# EAGLE design Active Probe Proto1 (EAGLE 6.1)
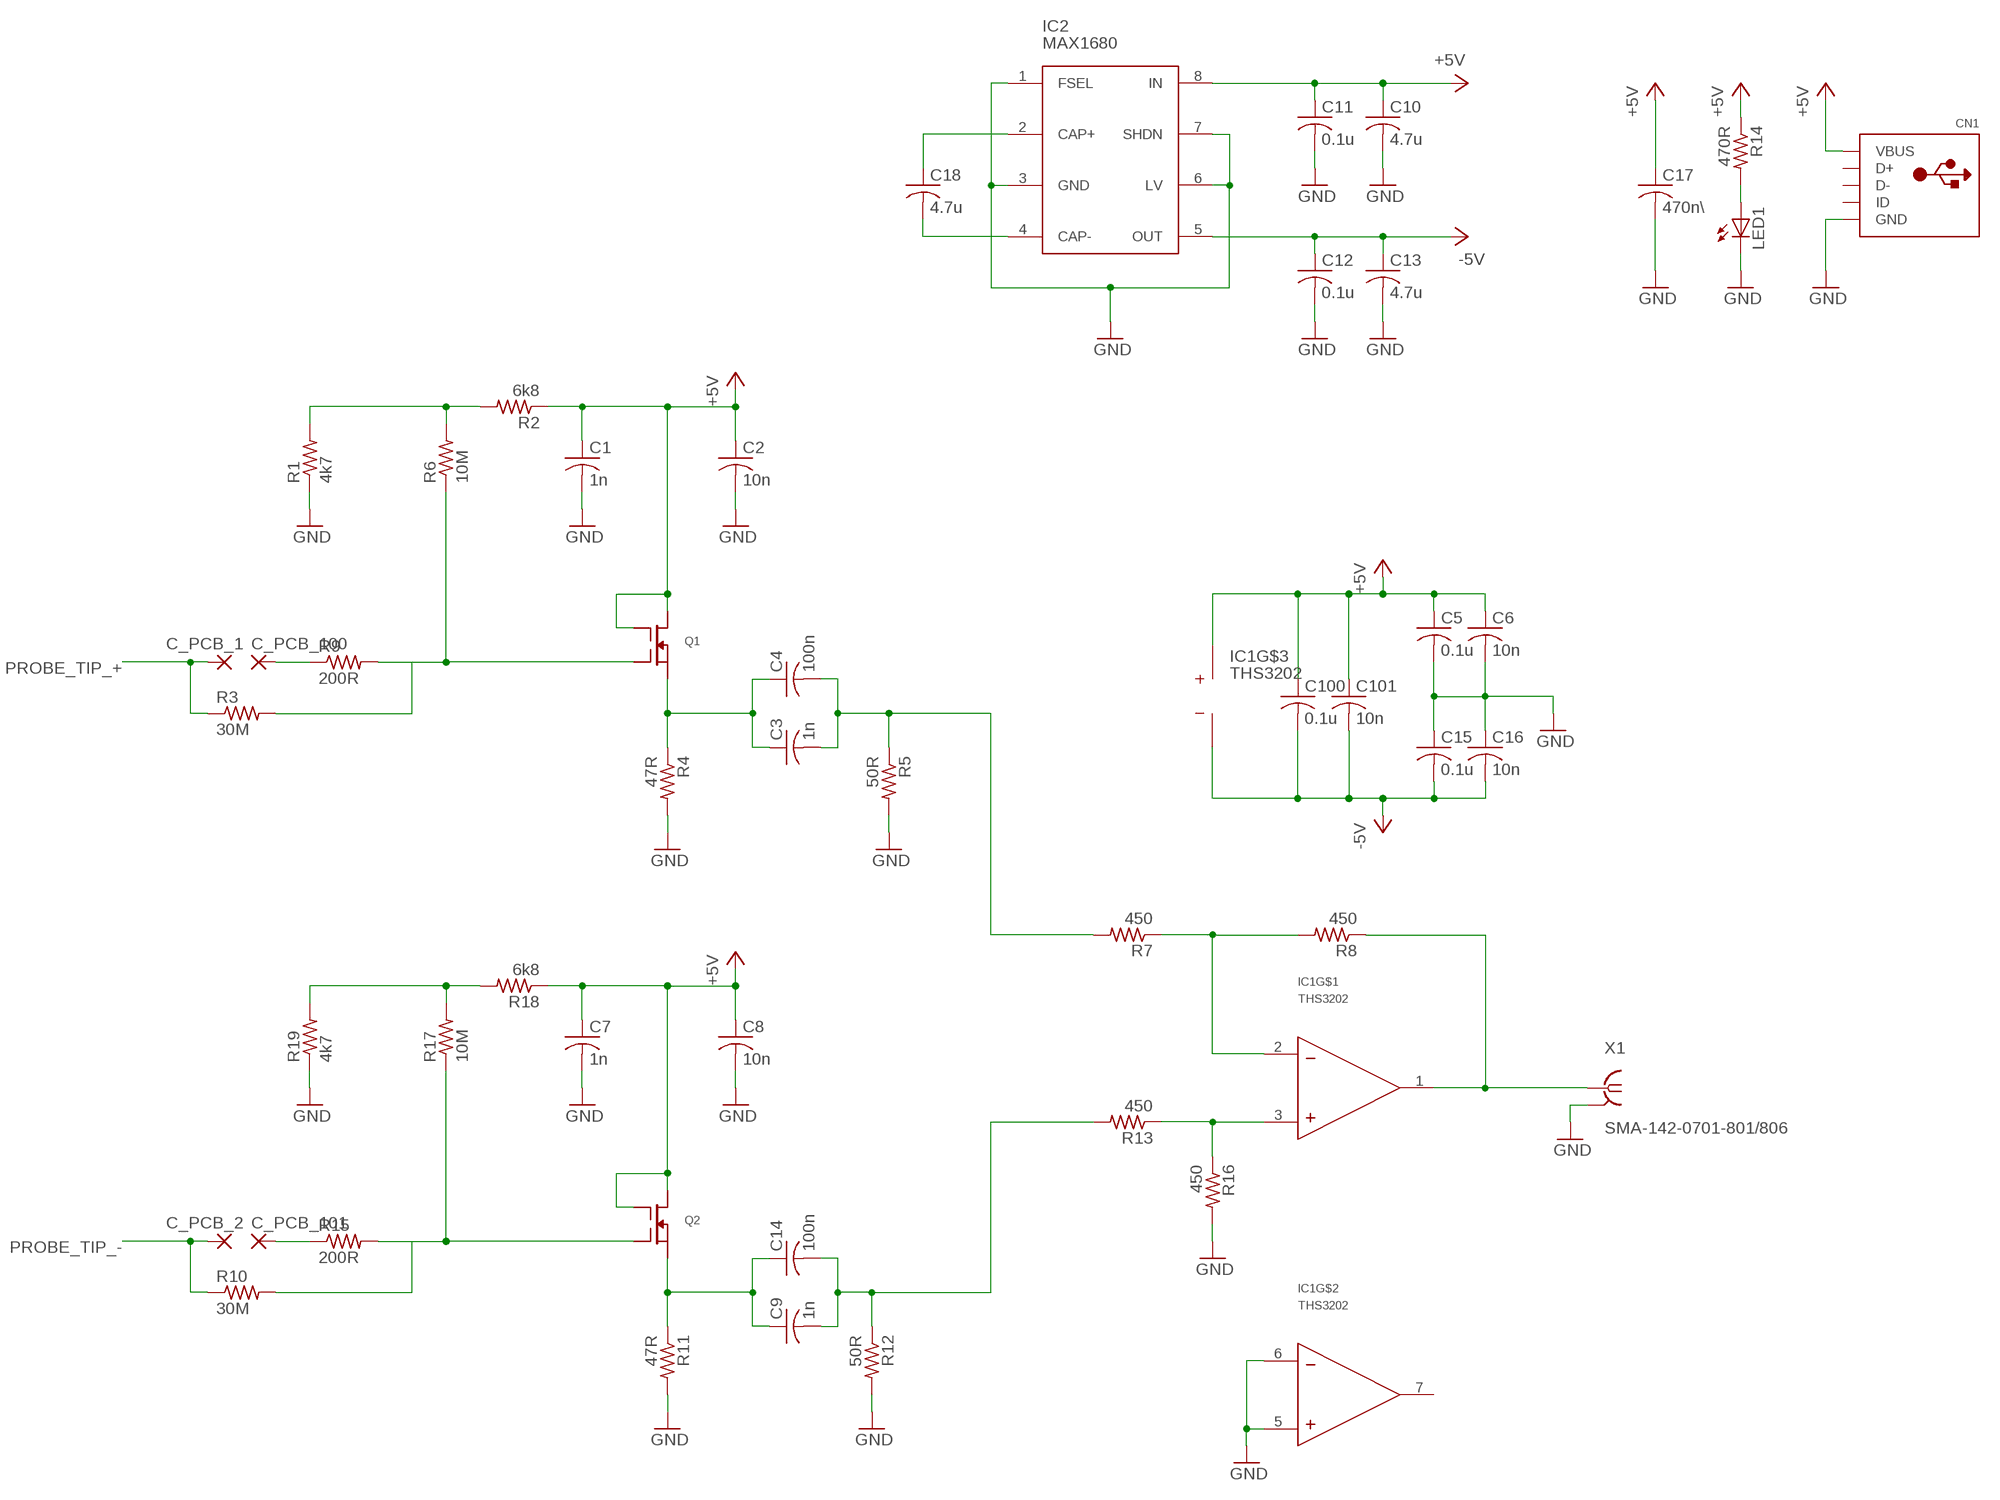
[diagram p0: schematic, sheet 1]

## Parts
C1  1n  C-USC0805  [C0805]
C2  10n  C-USC0805  [C0805]
C3  1n  C-USC0805  [C0805]
C4  100n  C-USC0805  [C0805]
C5  0.1u  C-USC0805  [C0805]
C6  10n  C-USC0805  [C0805]
C7  1n  C-USC0805  [C0805]
C8  10n  C-USC0805  [C0805]
C9  1n  C-USC0805  [C0805]
C10  4.7u  C-USC0805  [C0805]
C11  0.1u  C-USC0805  [C0805]
C12  0.1u  C-USC0805  [C0805]
C13  4.7u  C-USC0805  [C0805]
C14  100n  C-USC0805  [C0805]
C15  0.1u  C-USC0805  [C0805]
C16  10n  C-USC0805  [C0805]
C17  470n\  C-USC0805  [C0805]
C18  4.7u  C-USC0805  [C0805]
C100  0.1u  C-USC0805  [C0805]
C101  10n  C-USC0805  [C0805]
C_PCB_1  SMD5  [SMD2,54-5,08]
C_PCB_2  SMD5  [SMD2,54-5,08]
C_PCB_100  SMD5  [SMD2,54-5,08]
C_PCB_101  SMD5  [SMD2,54-5,08]
CN1  USBMINIB  [USB-MINIB]
IC1  THS3202  [SOIC8]
IC2  MAX1680  MAX1680/1  [SO8]
LED1  LED3MM  [LED3MM]
Q1  BF998  [SOT143B]
Q2  BF998  [SOT143B]
R1  4k7  R-US_R0805  [R0805]
R2  6k8  R-US_R0805  [R0805]
R3  30M  R-US_R0805  [R0805]
R4  47R  R-US_R0805  [R0805]
R5  50R  R-US_R0805  [R0805]
R6  10M  R-US_R0805  [R0805]
R7  450  R-US_R0805  [R0805]
R8  450  R-US_R0805  [R0805]
R9  200R  R-US_R0805  [R0805]
R10  30M  R-US_R0805  [R0805]
R11  47R  R-US_R0805  [R0805]
R12  50R  R-US_R0805  [R0805]
R13  450  R-US_R0805  [R0805]
R14  470R  R-US_R0805  [R0805]
R15  200R  R-US_R0805  [R0805]
R16  450  R-US_R0805  [R0805]
R17  10M  R-US_R0805  [R0805]
R18  6k8  R-US_R0805  [R0805]
R19  4k7  R-US_R0805  [R0805]
X1  SMA-142-0701-801/806  [J502-ND-142-0701-801/806]

## Nets
+5V: C1.1 C2.1 C5.1 C6.1 C7.1 C8.1 C10.1 C11.1 C17.1 C100.1 C101.1 CN1.VBUS IC1.8(VCC) IC2.8(IN) Q1.2(D) Q1.3(G2) Q2.2(D) Q2.3(G2) R2.1 R14.1 R18.1
-5V: C12.1 C13.1 C15.2 C16.2 C100.2 C101.2 IC1.4(GND) IC2.5(OUT)
GND: C1.2 C2.2 C5.2 C6.2 C7.2 C8.2 C10.2 C11.2 C12.2 C13.2 C15.1 C16.1 C17.2 CN1.GND IC1.5(IN+) IC1.6(IN-) IC2.1(FSEL) IC2.3(GND) IC2.6(LV) IC2.7(SHDN) LED1.K(C) R1.1 R4.2 R5.2 R11.2 R12.2 R16.2 R19.1 X1.G@1(GND)
N$1: R17.2 R18.2 R19.2
N$2: C3.1 C4.1 Q1.1(S) R4.1
N$3: R1.2 R2.2 R6.2
N$4: C_PCB_100.1(P) R9.1
N$5: C3.2 C4.2 R5.1 R7.2
N$6: Q1.4(G1) R3.2 R6.1 R9.2
N$7: C9.2 C14.2 R12.1 R13.2
N$8: Q2.4(G1) R10.2 R15.2 R17.1
N$9: C9.1 C14.1 Q2.1(S) R11.1
N$10: C_PCB_101.1(P) R15.1
N$11: LED1.A R14.2
N$13: IC1.1(OUT) R8.1 X1.1
N$14: C18.2 IC2.4(CAP-)
N$15: C18.1 IC2.2(CAP+)
N$16: IC1.3(IN+) R13.1 R16.1
N$17: IC1.2(IN-) R7.1 R8.2
PROBE_TIP_+: C_PCB_1.1(P) R3.1
PROBE_TIP_-: C_PCB_2.1(P) R10.1
Unconnected: CN1.D+ CN1.D- CN1.ID IC1.7(OUT)

## Power pins joined to a net without a drawn wire
GND: X1.G@2(GND) X1.G@3(GND) X1.G@4(GND)

## Library data of the parts
C1-C18 C100 C101 = rcl:C-US: CAPACITOR, American symbol
C_PCB_1 C_PCB_2 C_PCB_100 C_PCB_101 = wirepad:SMD5: SMD PAD
CN1 = adafruit:USB: USB Connectors USBMINIB - Surface Mount Female Mini-B USB Connector 4UConnector: 06564 By microbuilder.eu Thru-hole RA Female Mini-B USB Connector 4UConnector: 18732 By ladyada.net
IC1 = Kramnik's Library:THS3202
IC2 = Kramnik's Library:MAX1680/1: 125mA, Frequency-Selectable, Switched-Capacitor Voltage Converter Digikey: http://www.digikey.com/product-detail/en/MAX1681ESA%2B/MAX1681ESA%2B-ND/947772
LED1 = led:LED: LED OSRAM: - CHIPLED LG R971, LG N971, LY N971, LG Q971, LY Q971, LO R971, LY R971 LH N974, LH R974 LS Q976, LO Q976, LY Q976 LO Q996 - Hyper CHIPLED LW Q18S LB Q993, LB Q99A, LB R99A - SideLED LS A670, LO A670, LY A670, LG A670, LP A670 LB A673, LV A673, LT A673, LW A673 LH A674 LY A675 LS A676, LA A676, LO A676, LY A676, LW A676 LS A679, LY A679, LG A679 - Hyper Micro SIDELED® LS Y876, LA Y876, LO Y876, LY Y876 LT Y87S - SmartLED LW L88C, LW L88S LB L89C, LB L89S, LG L890 LS L89K, LO L89K, LY L89K LS L896, LA L896, LO L896, LY L896 - TOPLED LS T670, LO T670, LY T670, LG T670, LP T670 LSG T670, LSP T670, LSY T670, LOP T670, LYG T670 LG T671, LOG T671, LSG T671 LB T673, LV T673, LT T673, LW T673 LH T674 LS T676, LA T676, LO T676, LY T676, LB T676, LH T676, LSB T676, LW T676 LB T67C, LV T67C, LT T67C, LS T67K, LO T67K, LY T67K, LW E67C LS E67B, LA E67B, LO E67B, LY E67B, LB E67C, LV E67C, LT E67C LW T67C LS T679, LY T679, LG T679 LS T770, LO T770, LY T770, LG T770, LP T770 LB T773, LV T773, LT T773, LW T773 LH T774 LS E675, LA E675, LY E675, LS T675 LS T776, LA T776, LO T776, LY T776, LB T776 LHGB T686 LT T68C, LB T68C - Hyper Mini TOPLED® LB M676 - Mini TOPLED Santana® LG M470 LS M47K, LO M47K, LY M47K Source: http://www.osram.convergy.de LUXEON: - LUMILED® LXK2-PW12-R00, LXK2-PW12-S00, LXK2-PW14-U00, LXK2-PW14-V00 LXK2-PM12-R00, LXK2-PM12-S00, LXK2-PM14-U00 LXK2-PE12-Q00, LXK2-PE12-R00, LXK2-PE12-S00, LXK2-PE14-T00, LXK2-PE14-U00 LXK2-PB12-K00, LXK2-PB12-L00, LXK2-PB12-M00, LXK2-PB14-N00, LXK2-PB14-P00, LXK2-PB14-Q00 LXK2-PR12-L00, LXK2-PR12-M00, LXK2-PR14-Q00, LXK2-PR14-R00 LXK2-PD12-Q00, LXK2-PD12-R00, LXK2-PD12-S00 LXK2-PH12-R00, LXK2-PH12-S00 LXK2-PL12-P00, LXK2-PL12-Q00, LXK2-PL12-R00 Source: www.luxeon.com KINGBRIGHT: KA-3528ASYC Source: www.kingbright.com
Q1 Q2 = Kramnik's Library:BF998
R1-R19 = resistor:R-US_: RESISTOR, American symbol
X1 = con-coax:SMA-: SMA 50 Ohm End Launch Jack Receptacle - Round Contact Johnson Components Source: www.johnsoncomponents.com .. J502-ND.pdf; MF: JOHNSON COMPONENTS; MPN: 142-0701-801; OC_FARNELL: 1608592; OC_NEWARK: 90F2624

## Board
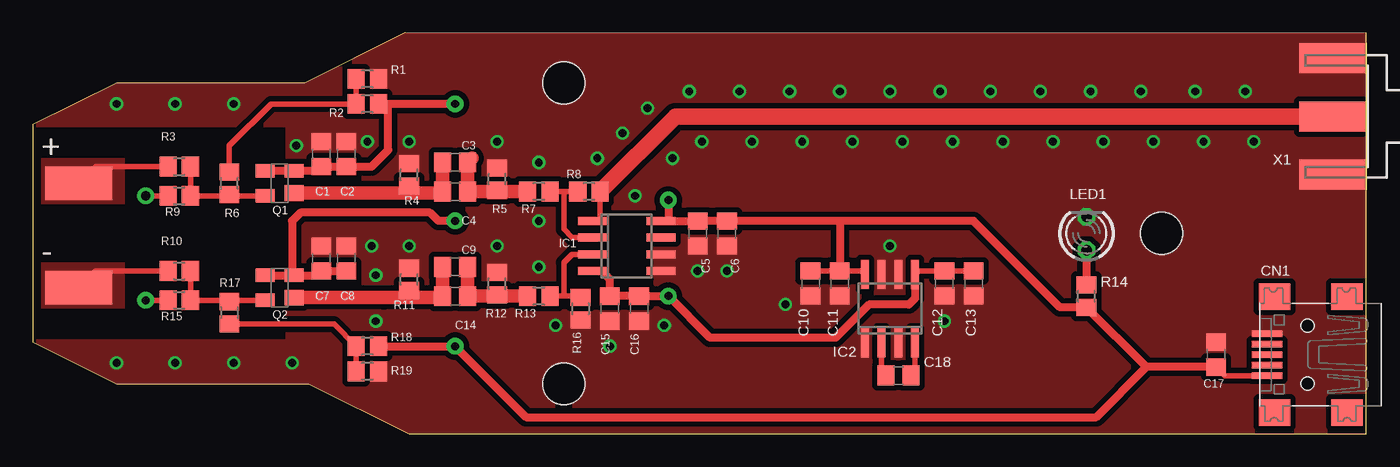
[diagram p1: board, top side]
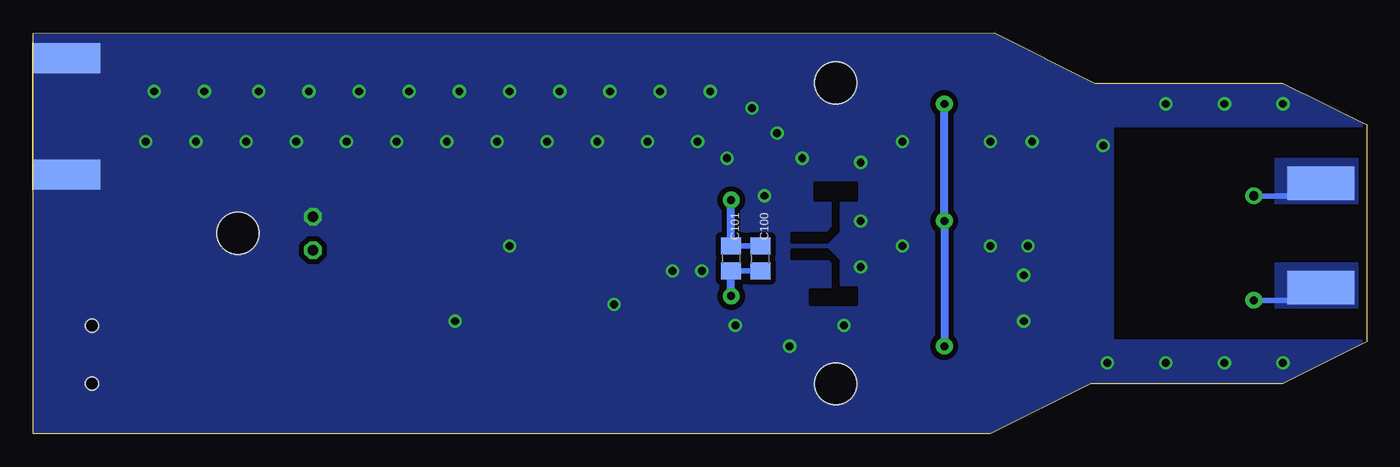
[diagram p2: board, bottom side, seen from below]

Size 101.28 x 30.48 mm. Coordinates in mm from the lower left corner, seen from the top.
Outline: 20.96,3.81 28.57,0 101.26,0 101.26,30.47 28.26,30.48 20.64,26.67 6.35,26.67 0,23.5 0,6.99 6.35,3.81 20.96,3.81
Copper layers (1*16): Top 0.035mm / dielectric 1.5mm / Bottom 0.035mm
Design rules: minimum track width 10mil, minimum drill 24mil, track to track 16mil, track to pad 16mil, pad to pad 16mil, via to via 16mil, smd to smd 1mil, copper to edge 1mil, drill to drill 8mil, minimum pad ring 10mil, minimum via ring 8mil, stop-mask expansion 4mil, vias tented up to drill 0mil, thermal gap 10mil
Holes 3.2 mm at 85.73,15.24 40.32,26.67 40.32,3.81
tRestrict: area 43.2,11.7 to 47,16.8
bRestrict: area 38.7,14.6 to 43.7,19.1; area 38.7,9.8 to 43.7,14

### Footprints (pad centres in the part's own frame; a part is rotated, then mirrored left to right if it is on the bottom)
C0805 = smd 1.3 x 1.5: 1 -0.95,0; 2 0.95,0
SMD2,54-5,08 = smd 2.54 x 5.08: 1 0,0
USB-MINIB = smd 0.5 x 2.308: D+ 0,4.064; D- -0.8,4.064; GND 1.6,4.064; ID 0.8,4.064; VBUS -1.6,4.064 | smd 2 x 2.4: GND1 -4.4,-2; GND2 -4.4,3.5; GND3 4.4,3.5; GND4 4.4,-2 | hole 1: -2.2,1; 2.2,1
SOIC8 = smd 0.6 x 2.2: 1 -1.905,-2.6; 2 -0.635,-2.6; 3 0.635,-2.6; 4 1.905,-2.6; 5 1.905,2.6; 6 0.635,2.6; 7 -0.635,2.6; 8 -1.905,2.6
SO8 = smd 0.6 x 2.2: 1 -1.905,-2.6; 2 -0.635,-2.6; 3 0.635,-2.6; 4 1.905,-2.6; 5 1.905,2.6; 6 0.635,2.6; 7 -0.635,2.6; 8 -1.905,2.6
LED3MM = drill 0.813 octagon: A -1.27,0; K 1.27,0
SOT143B = smd 1.2 x 1.44: 1 -0.75,-1.1 | smd 1 x 1.44: 2 0.95,-1.1; 3 0.95,1.1; 4 -0.95,1.1
R0805 = smd 1.3 x 1.5: 1 -0.85,0; 2 0.85,0
J502-ND-142-0701-801/806 = smd 5.08 x 2.286: 1 2.565,0; G@1 2.565,4.42; G@2 2.565,-4.42 | smd 5.08 x 2.286 bottom: G@3 2.565,4.42; G@4 2.565,-4.42

### Placement (x,y rotation side)
C1  21.91,21.27 90 top
C2  23.81,21.27 90 top
C3  32.07,20.64 0 top
C4  32.07,18.41 0 top
C5  50.48,15.24 270 top
C6  52.7,15.24 270 top
C7  21.91,13.34 90 top
C8  23.81,13.34 90 top
C9  32.07,12.7 0 top
C10  59.05,11.43 270 top
C11  61.28,11.43 270 top
C12  69.22,11.43 270 top
C13  71.44,11.43 270 top
C14  32.07,10.48 0 top
C15  43.81,9.53 90 top
C16  46.04,9.53 90 top
C17  89.85,6.03 90 top
C18  65.72,4.45 0 top
C100  46.04,13.34 270 bottom
C101  48.26,13.34 270 bottom
C_PCB_1  3.49,19.05 270 top
C_PCB_2  3.49,11.11 270 top
C_PCB_100  3.49,19.05 90 bottom
C_PCB_101  3.49,11.11 90 bottom
CN1  97.79,6.03 90 top
IC1  45.09,14.29 270 top
IC2  65.09,9.53 0 top
LED1  80.01,15.24 90 top
Q1  18.73,19.05 90 top
Q2  18.73,11.11 90 top
R1  25.4,26.99 180 top
R2  25.4,25.08 180 top
R3  11.11,20.32 0 top
R4  28.57,19.68 90 top
R5  35.24,19.37 90 top
R6  14.92,19.05 90 top
R7  38.42,18.41 180 top
R8  42.23,18.41 180 top
R9  11.11,18.1 0 top
R10  11.11,12.38 0 top
R11  28.57,11.75 90 top
R12  35.24,11.43 90 top
R13  38.42,10.48 180 top
R14  80.01,10.48 90 top
R15  11.11,10.16 0 top
R16  41.59,9.53 270 top
R17  14.92,9.21 270 top
R18  25.4,6.67 180 top
R19  25.4,4.76 180 top
X1  101.28,24.13 180 top

### Tracks (layer width: path | path; a pad name or v marks a point on that pad's centre or on a via)
+5V  (via drill 0.6 pad 1.27)
  Top 0.254: 20,12.06 Q2.2 | C2.1 | C5.1
  Top 0.406: CN1.VBUS 90.5,4.43 C17.1 | C10.1 C11.1 62.93,12.38 IC2.8
  Top 0.61: v32.07,25.08 26.99,25.08 | v32.07,16.19 30.8,16.19 30.16,16.83 20.32,16.83 19.69,16.19 19.69,12.38 20,12.06 21.59,12.06 C7.1 C8.1 | Q2.3 Q2.2 | Q1.3 Q1.2 21.58,20 C1.1 C2.1 | R18.1 v32.07,6.67 37.46,1.27 80.74,1.27 84.56,5.08 | C5.1 C6.1 61.28,16.19 | IC1.8 48.26,16.19 | 48.26,16.19 C5.1 | v48.26,17.78 48.26,16.19 | C17.1 84.56,5.08 | 84.56,5.08 R14.1 78,9.63 71.44,16.19 61.28,16.19 | 61.28,16.19 C11.1 | C2.1 25.72,20.32 26.99,21.59 26.99,25.08 | R2.1 26.99,25.08
  Bottom 0.406: C101.1 C100.1
  Bottom 0.61: v32.07,25.08 v32.07,16.19 v32.07,6.67 | C101.1 v48.26,17.78
-5V  (via drill 0.6 pad 1.27)
  Top 0.406: C13.1 C12.1 67.25,12.38 IC2.5
  Top 0.61: IC2.5 66.99,10.32 66.52,9.84 63.5,9.84 60.96,7.3 51.43,7.3 v48.26,10.48 v48.26,10.47 C16.2 C15.2 43.82,11.75 43.18,12.38 IC1.4
  Bottom 0.254: C101.2
  Bottom 0.406: C101.2 C100.2
  Bottom 0.61: v48.26,10.48 C101.2
GND  (via drill 0.6)
  other vias: 25.72,14.29 26.04,12.06 28.57,14.29 6.35,25.08 10.79,25.08 15.24,25.08 6.35,5.4 10.79,5.4 15.24,5.4 19.69,5.4 42.86,20.95 44.77,22.86 46.67,24.77 45.72,18.1 48.58,20.95 50.8,22.23 49.85,26.04 53.66,26.04 57.47,26.04 61.28,26.04 65.09,26.04 68.9,26.04 72.71,26.04 76.52,26.04 80.33,26.04 54.61,22.23 58.42,22.23 62.23,22.23 66.04,22.23 69.85,22.23 73.66,22.23 84.14,26.04 88.27,26.04 92.08,26.04 77.47,22.23 81.28,22.23 85.09,22.23 88.9,22.23 92.71,22.23 65.09,14.29 20,21.91 25.4,22.23 28.57,22.23 35.24,14.29 35.24,22.23 57.15,9.84 39.69,8.26 50.48,12.38 52.7,12.38 47.94,8.26 43.81,6.67 69.22,8.57 26.04,8.57 38.42,20.64 38.42,16.19 38.42,12.7
  pour Top (no thermals): 101.92,31.43 -0.95,31.75 -0.95,23.5 19.37,23.5 19.37,6.99 -0.95,6.99 -0.95,-0.95 101.92,-0.64
  pour Bottom (no thermals): 101.92,31.11 101.92,-0.32 -0.32,-0.95 -0.32,6.99 19.37,6.99 19.37,23.5 -0.64,23.5 -0.64,31.11
N$1
  Top 0.406: R19.2 R18.2 22.86,8.36 R17.2
N$2
  Top 0.406: 31,18.3 C4.1
  Top 1.016: C3.1 C4.1 | 31,18.3 28.57,18.3 | 28.57,18.3 26.67,18.3 Q1.1 | R4.1 28.57,18.3
N$3
  Top 0.406: R1.2 R2.2 18.1,25.08 14.92,21.91 R6.2
N$4  (via drill 0.7 pad 1.27)
  Top 0.406: R9.1 v8.57,18.1
  Bottom 0.406: C_PCB_100.1 4.45,18.1 v8.57,18.1
  pour Bottom (no thermals): 6.99,20.95 0.64,20.95 0.64,17.46 6.99,17.46
N$5
  Top 1.016: 33.34,20.95 C3.2 C4.2 35.14,18.41 R5.1 35.35,18.41 R7.2
N$6
  Top 0.406: R3.2 R9.2 14.29,18.1 | Q1.4 14.29,18.1 | R6.1 14.39,18.2 14.29,18.1
N$7
  Top 1.016: C9.2 C14.2 35.14,10.48 R12.1 35.35,10.48 R13.2
N$8
  Top 0.406: R10.2 R15.2 12.28,10.16 14.92,10.16 | Q2.4 14.92,10.16 | R17.1 14.92,10.16
N$9
  Top 0.406: 31,10.36 C14.1
  Top 1.016: C9.1 C14.1 | 31,10.36 28.57,10.36 | 28.57,10.36 26.67,10.36 Q2.1 | R11.1 28.57,10.36
N$10  (via drill 0.6 pad 1.27)
  Top 0.406: R15.1 v8.57,10.16
  Bottom 0.406: v8.57,10.16 4.45,10.16 C_PCB_101.1
  pour Bottom (no thermals): 6.99,13.02 0.64,13.02 0.64,9.53 6.99,9.53
N$11
  Top 0.61: LED1.A R14.2
N$13
  Top 0.406: R8.1 43.08,16.19 IC1.1
  Top 1.27: X1.1 48.79,24.13 R8.1
N$14
  Top 0.406: IC2.4 66.99,4.45 C18.2
N$15
  Top 0.406: IC2.2 64.45,4.45 C18.1
N$16
  Top 0.406: 40.32,10.48 R13.1 | IC1.3 40.96,13.65 40.32,13.02 40.32,10.48 | 40.32,10.48 41.49,10.48 R16.1
N$17
  Top 0.406: R8.2 40.32,18.41 | 40.32,18.41 R7.1 | IC1.2 40.96,14.92 40.32,15.56 40.32,18.41
PROBE_TIP_+
  Top 0.406: R3.1 4.76,20.32 C_PCB_1.1
  pour Top (no thermals): 6.99,17.46 6.99,20.95 0.64,20.95 0.64,17.46
PROBE_TIP_-
  Top 0.406: R10.1 4.76,12.38 C_PCB_2.1
  pour Top (no thermals): 6.99,9.53 6.99,13.02 0.64,13.02 0.64,9.53

### Text on the board
tNames: + | -